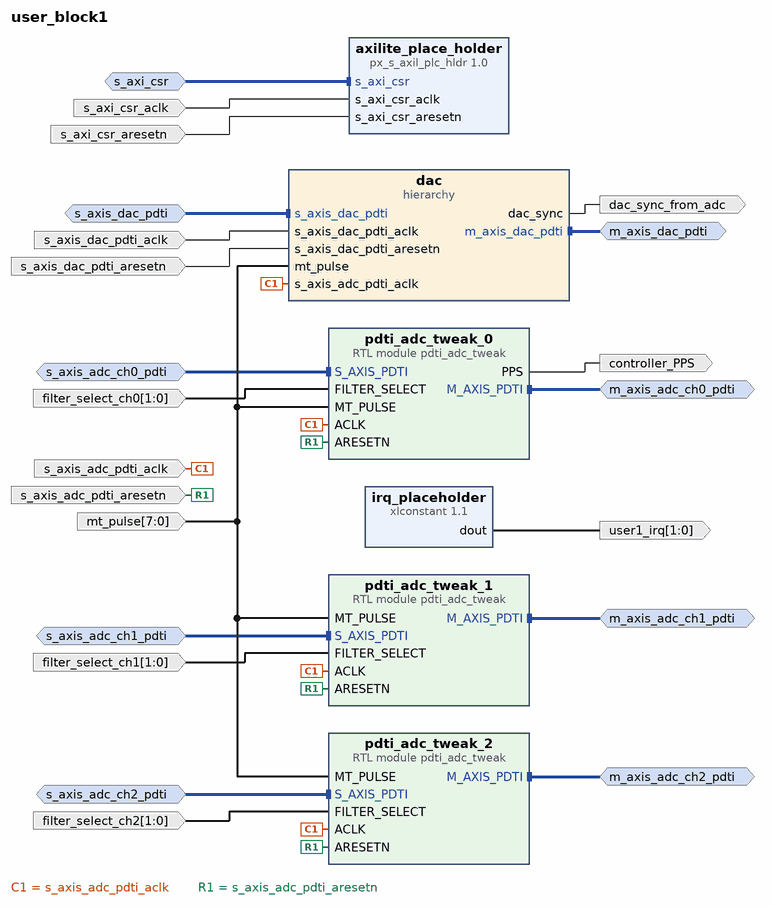
[diagram p0: block diagram of the top level]
# Vivado block design user_block1, xcku060-ffva1156-2-e, Vivado 2019.2
create_bd_design user_block1

create_bd_intf_port -mode Slave -vlnv xilinx.com:interface:aximm_rtl:1.0 s_axi_csr
set_property -dict [list \
  CONFIG.DATA_WIDTH 32 \
  CONFIG.PROTOCOL AXI4LITE \
  CONFIG.ID_WIDTH 0 \
  CONFIG.ADDR_WIDTH 26 \
  CONFIG.AWUSER_WIDTH 0 \
  CONFIG.ARUSER_WIDTH 0 \
  CONFIG.WUSER_WIDTH 0 \
  CONFIG.RUSER_WIDTH 0 \
  CONFIG.BUSER_WIDTH 0 \
  CONFIG.READ_WRITE_MODE READ_WRITE \
  CONFIG.HAS_BURST 0 \
  CONFIG.HAS_LOCK 0 \
  CONFIG.HAS_PROT 1 \
  CONFIG.HAS_CACHE 0 \
  CONFIG.HAS_QOS 0 \
  CONFIG.HAS_REGION 0 \
  CONFIG.HAS_WSTRB 1 \
  CONFIG.HAS_BRESP 1 \
  CONFIG.HAS_RRESP 1 \
  CONFIG.SUPPORTS_NARROW_BURST 0 \
  CONFIG.NUM_READ_OUTSTANDING 1 \
  CONFIG.NUM_WRITE_OUTSTANDING 1 \
  CONFIG.MAX_BURST_LENGTH 1 \
  CONFIG.NUM_READ_THREADS 1 \
  CONFIG.NUM_WRITE_THREADS 1 \
  CONFIG.RUSER_BITS_PER_BYTE 0 \
  CONFIG.WUSER_BITS_PER_BYTE 0 \
] [get_bd_intf_ports s_axi_csr]
create_bd_intf_port -mode Master -vlnv xilinx.com:interface:axis_rtl:1.0 m_axis_adc_ch0_pdti
set_property -dict [list \
  CONFIG.FREQ_HZ 200000000 \
  CONFIG.CLK_DOMAIN user_block1_s_axis_adc_pdti_aclk \
] [get_bd_intf_ports m_axis_adc_ch0_pdti]
create_bd_intf_port -mode Slave -vlnv xilinx.com:interface:axis_rtl:1.0 s_axis_adc_ch0_pdti
set_property -dict [list \
  CONFIG.TDATA_NUM_BYTES 2 \
  CONFIG.TDEST_WIDTH 0 \
  CONFIG.TID_WIDTH 0 \
  CONFIG.TUSER_WIDTH 128 \
  CONFIG.HAS_TREADY 0 \
  CONFIG.HAS_TSTRB 0 \
  CONFIG.HAS_TKEEP 0 \
  CONFIG.HAS_TLAST 0 \
  CONFIG.LAYERED_METADATA undef \
] [get_bd_intf_ports s_axis_adc_ch0_pdti]
create_bd_intf_port -mode Master -vlnv xilinx.com:interface:axis_rtl:1.0 m_axis_adc_ch1_pdti
set_property -dict [list \
  CONFIG.FREQ_HZ 200000000 \
  CONFIG.CLK_DOMAIN user_block1_s_axis_adc_pdti_aclk \
] [get_bd_intf_ports m_axis_adc_ch1_pdti]
create_bd_intf_port -mode Slave -vlnv xilinx.com:interface:axis_rtl:1.0 s_axis_adc_ch1_pdti
set_property -dict [list \
  CONFIG.TDATA_NUM_BYTES 2 \
  CONFIG.TDEST_WIDTH 0 \
  CONFIG.TID_WIDTH 0 \
  CONFIG.TUSER_WIDTH 128 \
  CONFIG.HAS_TREADY 0 \
  CONFIG.HAS_TSTRB 0 \
  CONFIG.HAS_TKEEP 0 \
  CONFIG.HAS_TLAST 0 \
  CONFIG.LAYERED_METADATA undef \
] [get_bd_intf_ports s_axis_adc_ch1_pdti]
create_bd_intf_port -mode Master -vlnv xilinx.com:interface:axis_rtl:1.0 m_axis_adc_ch2_pdti
set_property -dict [list \
  CONFIG.FREQ_HZ 200000000 \
  CONFIG.CLK_DOMAIN user_block1_s_axis_adc_pdti_aclk \
] [get_bd_intf_ports m_axis_adc_ch2_pdti]
create_bd_intf_port -mode Slave -vlnv xilinx.com:interface:axis_rtl:1.0 s_axis_adc_ch2_pdti
set_property -dict [list \
  CONFIG.TDATA_NUM_BYTES 2 \
  CONFIG.TDEST_WIDTH 0 \
  CONFIG.TID_WIDTH 0 \
  CONFIG.TUSER_WIDTH 128 \
  CONFIG.HAS_TREADY 0 \
  CONFIG.HAS_TSTRB 0 \
  CONFIG.HAS_TKEEP 0 \
  CONFIG.HAS_TLAST 0 \
  CONFIG.LAYERED_METADATA undef \
] [get_bd_intf_ports s_axis_adc_ch2_pdti]
create_bd_intf_port -mode Slave -vlnv xilinx.com:interface:axis_rtl:1.0 s_axis_dac_pdti
set_property -dict [list \
  CONFIG.TDATA_NUM_BYTES 4 \
  CONFIG.TDEST_WIDTH 0 \
  CONFIG.TID_WIDTH 0 \
  CONFIG.TUSER_WIDTH 128 \
  CONFIG.HAS_TREADY 0 \
  CONFIG.HAS_TSTRB 0 \
  CONFIG.HAS_TKEEP 0 \
  CONFIG.HAS_TLAST 0 \
  CONFIG.LAYERED_METADATA undef \
] [get_bd_intf_ports s_axis_dac_pdti]
create_bd_intf_port -mode Master -vlnv xilinx.com:interface:axis_rtl:1.0 m_axis_dac_pdti
set_property -dict [list \
  CONFIG.FREQ_HZ 250000000 \
  CONFIG.CLK_DOMAIN user_block1_s_axis_dac_pdti_aclk \
] [get_bd_intf_ports m_axis_dac_pdti]
create_bd_port -dir I -type clk s_axi_csr_aclk
set_property -dict {CONFIG.ASSOCIATED_BUSIF s_axi_csr CONFIG.FREQ_HZ 250000000} [get_bd_ports s_axi_csr_aclk]
create_bd_port -dir I -type rst s_axi_csr_aresetn
create_bd_port -dir O -from 1 -to 0 user1_irq
create_bd_port -dir I -type clk s_axis_adc_pdti_aclk
set_property -dict [list \
  CONFIG.ASSOCIATED_BUSIF s_axis_adc_ch0_pdti:s_axis_adc_ch1_pdti:s_axis_adc_ch2_pdti:m_axis_adc_ch0_pdti:m_axis_adc_ch1_pdti:m_axis_adc_ch2_pdti \
  CONFIG.ASSOCIATED_RESET s_axis_adc_pdti_aresetn \
  CONFIG.CLK_DOMAIN user_block1_s_axis_adc_pdti_aclk \
  CONFIG.FREQ_HZ 200000000 \
] [get_bd_ports s_axis_adc_pdti_aclk]
create_bd_port -dir I -from 7 -to 0 mt_pulse
create_bd_port -dir I -type rst s_axis_adc_pdti_aresetn
create_bd_port -dir I -type clk s_axis_dac_pdti_aclk
set_property -dict [list \
  CONFIG.ASSOCIATED_BUSIF s_axis_dac_pdti:m_axis_dac_pdti \
  CONFIG.ASSOCIATED_RESET s_axis_dac_pdti_aresetn:s_axis_dac_pdti_aresetn \
  CONFIG.CLK_DOMAIN user_block1_s_axis_dac_pdti_aclk \
  CONFIG.FREQ_HZ 250000000 \
] [get_bd_ports s_axis_dac_pdti_aclk]
create_bd_port -dir I -type rst s_axis_dac_pdti_aresetn
create_bd_port -dir I -from 1 -to 0 filter_select_ch0
create_bd_port -dir O controller_PPS
create_bd_port -dir I -from 1 -to 0 filter_select_ch1
create_bd_port -dir I -from 1 -to 0 filter_select_ch2
create_bd_port -dir O dac_sync_from_adc

create_bd_cell -type hier dac
create_bd_cell -type module -reference pdti_adc_tweak pdti_adc_tweak_0
create_bd_cell -type module -reference pdti_adc_tweak pdti_adc_tweak_1
set_property -dict {CONFIG.mt_pulse_bit 2} [get_bd_cells pdti_adc_tweak_1]
create_bd_cell -type module -reference pdti_adc_tweak pdti_adc_tweak_2
set_property -dict {CONFIG.mt_pulse_bit 3} [get_bd_cells pdti_adc_tweak_2]
create_bd_cell -type ip -vlnv pentek.com:px_ip:px_s_axil_plc_hldr:1.0 axilite_place_holder
set_property -dict {CONFIG.address_width 26} [get_bd_cells axilite_place_holder]
create_bd_cell -type ip -vlnv xilinx.com:ip:xlconstant:1.1 irq_placeholder
set_property -dict {CONFIG.CONST_VAL 0 CONFIG.CONST_WIDTH 2} [get_bd_cells irq_placeholder]

# ---- hierarchy /dac ----
current_bd_instance /dac
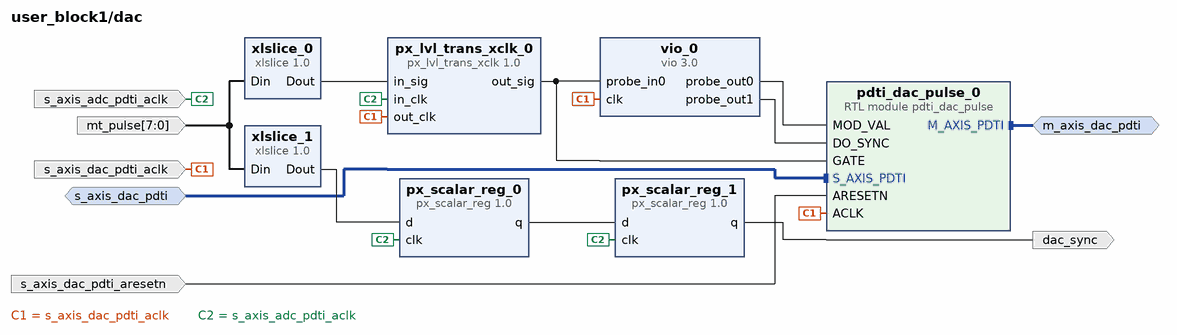
[diagram p1: block diagram inside /dac]
create_bd_intf_pin -mode Slave -vlnv xilinx.com:interface:axis_rtl:1.0 s_axis_dac_pdti
create_bd_intf_pin -mode Master -vlnv xilinx.com:interface:axis_rtl:1.0 m_axis_dac_pdti
create_bd_pin -dir I -type clk s_axis_dac_pdti_aclk
create_bd_pin -dir I -type rst s_axis_dac_pdti_aresetn
create_bd_pin -dir I -type clk s_axis_adc_pdti_aclk
create_bd_pin -dir I -from 7 -to 0 mt_pulse
create_bd_pin -dir O dac_sync

create_bd_cell -type module -reference pdti_dac_pulse pdti_dac_pulse_0
create_bd_cell -type ip -vlnv pentek.com:user:px_lvl_trans_xclk:1.0 px_lvl_trans_xclk_0
create_bd_cell -type ip -vlnv xilinx.com:ip:vio:3.0 vio_0
set_property -dict [list \
  CONFIG.C_NUM_PROBE_OUT 2 \
  CONFIG.C_PROBE_OUT0_INIT_VAL 0x00007FFF \
  CONFIG.C_PROBE_OUT0_WIDTH 32 \
  CONFIG.C_PROBE_OUT1_INIT_VAL 0x1 \
] [get_bd_cells vio_0]
create_bd_cell -type ip -vlnv xilinx.com:ip:xlslice:1.0 xlslice_0
set_property -dict {CONFIG.DIN_FROM 4 CONFIG.DIN_TO 4 CONFIG.DIN_WIDTH 8 CONFIG.DOUT_WIDTH 1} [get_bd_cells xlslice_0]
create_bd_cell -type ip -vlnv pentek.com:px_ip:px_scalar_reg:1.0 px_scalar_reg_0
create_bd_cell -type ip -vlnv pentek.com:px_ip:px_scalar_reg:1.0 px_scalar_reg_1
create_bd_cell -type ip -vlnv xilinx.com:ip:xlslice:1.0 xlslice_1
set_property -dict {CONFIG.DIN_FROM 7 CONFIG.DIN_TO 7 CONFIG.DIN_WIDTH 8 CONFIG.DOUT_WIDTH 1} [get_bd_cells xlslice_1]

# ---- connections ----

current_bd_instance /dac
connect_bd_intf_net -intf_net Conn1 [get_bd_intf_pins m_axis_dac_pdti] [get_bd_intf_pins pdti_dac_pulse_0/M_AXIS_PDTI]
connect_bd_intf_net [get_bd_intf_pins s_axis_dac_pdti] [get_bd_intf_pins pdti_dac_pulse_0/S_AXIS_PDTI]
connect_bd_net -net aresetn_1 [get_bd_pins s_axis_dac_pdti_aresetn] [get_bd_pins pdti_dac_pulse_0/ARESETN]
connect_bd_net -net aclk_1 [get_bd_pins s_axis_dac_pdti_aclk] \
  [get_bd_pins pdti_dac_pulse_0/ACLK] [get_bd_pins px_lvl_trans_xclk_0/out_clk] [get_bd_pins vio_0/clk]
connect_bd_net [get_bd_pins px_lvl_trans_xclk_0/out_sig] [get_bd_pins pdti_dac_pulse_0/GATE] [get_bd_pins vio_0/probe_in0]
connect_bd_net [get_bd_pins s_axis_adc_pdti_aclk] \
  [get_bd_pins px_lvl_trans_xclk_0/in_clk] [get_bd_pins px_scalar_reg_1/clk] [get_bd_pins px_scalar_reg_0/clk]
connect_bd_net [get_bd_pins xlslice_0/Dout] [get_bd_pins px_lvl_trans_xclk_0/in_sig]
connect_bd_net [get_bd_pins mt_pulse] [get_bd_pins xlslice_0/Din] [get_bd_pins xlslice_1/Din]
connect_bd_net [get_bd_pins vio_0/probe_out0] [get_bd_pins pdti_dac_pulse_0/MOD_VAL]
connect_bd_net [get_bd_pins vio_0/probe_out1] [get_bd_pins pdti_dac_pulse_0/DO_SYNC]
connect_bd_net [get_bd_pins px_scalar_reg_0/q] [get_bd_pins px_scalar_reg_1/d]
connect_bd_net [get_bd_pins xlslice_1/Dout] [get_bd_pins px_scalar_reg_0/d]
connect_bd_net [get_bd_pins px_scalar_reg_1/q] [get_bd_pins dac_sync]
set_property HDL_ATTRIBUTE.DEBUG true [get_bd_intf_nets Conn1]
set_property HDL_ATTRIBUTE.MARK_DEBUG true [get_bd_intf_nets Conn1]

current_bd_instance /
connect_bd_intf_net [get_bd_intf_ports m_axis_adc_ch1_pdti] [get_bd_intf_pins pdti_adc_tweak_1/M_AXIS_PDTI]
connect_bd_intf_net [get_bd_intf_ports m_axis_adc_ch0_pdti] [get_bd_intf_pins pdti_adc_tweak_0/M_AXIS_PDTI]
connect_bd_intf_net [get_bd_intf_ports s_axis_adc_ch0_pdti] [get_bd_intf_pins pdti_adc_tweak_0/S_AXIS_PDTI]
connect_bd_intf_net -intf_net dac_M_AXIS_PDTI [get_bd_intf_ports m_axis_dac_pdti] [get_bd_intf_pins dac/m_axis_dac_pdti]
connect_bd_intf_net [get_bd_intf_ports s_axis_dac_pdti] [get_bd_intf_pins dac/s_axis_dac_pdti]
connect_bd_intf_net [get_bd_intf_ports s_axis_adc_ch2_pdti] [get_bd_intf_pins pdti_adc_tweak_2/S_AXIS_PDTI]
connect_bd_intf_net [get_bd_intf_ports s_axis_adc_ch1_pdti] [get_bd_intf_pins pdti_adc_tweak_1/S_AXIS_PDTI]
connect_bd_intf_net [get_bd_intf_ports s_axi_csr] [get_bd_intf_pins axilite_place_holder/s_axi_csr]
connect_bd_intf_net [get_bd_intf_ports m_axis_adc_ch2_pdti] [get_bd_intf_pins pdti_adc_tweak_2/M_AXIS_PDTI]
connect_bd_net [get_bd_ports s_axi_csr_aclk] [get_bd_pins axilite_place_holder/s_axi_csr_aclk]
connect_bd_net [get_bd_ports s_axi_csr_aresetn] [get_bd_pins axilite_place_holder/s_axi_csr_aresetn]
connect_bd_net -net xlconstant_0_dout [get_bd_pins irq_placeholder/dout] [get_bd_ports user1_irq]
connect_bd_net [get_bd_ports s_axis_adc_pdti_aclk] \
  [get_bd_pins pdti_adc_tweak_0/ACLK] [get_bd_pins pdti_adc_tweak_1/ACLK] [get_bd_pins pdti_adc_tweak_2/ACLK] \
  [get_bd_pins dac/s_axis_adc_pdti_aclk]
connect_bd_net [get_bd_ports mt_pulse] \
  [get_bd_pins pdti_adc_tweak_0/MT_PULSE] [get_bd_pins pdti_adc_tweak_1/MT_PULSE] [get_bd_pins pdti_adc_tweak_2/MT_PULSE] \
  [get_bd_pins dac/mt_pulse]
connect_bd_net [get_bd_ports s_axis_adc_pdti_aresetn] \
  [get_bd_pins pdti_adc_tweak_0/ARESETN] [get_bd_pins pdti_adc_tweak_1/ARESETN] [get_bd_pins pdti_adc_tweak_2/ARESETN]
connect_bd_net [get_bd_ports s_axis_dac_pdti_aclk] [get_bd_pins dac/s_axis_dac_pdti_aclk]
connect_bd_net [get_bd_ports s_axis_dac_pdti_aresetn] [get_bd_pins dac/s_axis_dac_pdti_aresetn]
connect_bd_net -net filter_select_ch0_1 [get_bd_ports filter_select_ch0] [get_bd_pins pdti_adc_tweak_0/FILTER_SELECT]
connect_bd_net [get_bd_pins pdti_adc_tweak_0/PPS] [get_bd_ports controller_PPS]
connect_bd_net -net filter_select_ch1_1 [get_bd_ports filter_select_ch1] [get_bd_pins pdti_adc_tweak_1/FILTER_SELECT]
connect_bd_net -net filter_select_ch2_1 [get_bd_ports filter_select_ch2] [get_bd_pins pdti_adc_tweak_2/FILTER_SELECT]
connect_bd_net -net dac_sync_from_adc [get_bd_pins dac/dac_sync] [get_bd_ports dac_sync_from_adc]
set_property HDL_ATTRIBUTE.DEBUG true [get_bd_intf_nets dac_M_AXIS_PDTI]

# ---- address map ----
assign_bd_address -offset 0x3000000 -range 8M -target_address_space [get_bd_addr_spaces s_axi_csr] [get_bd_addr_segs axilite_place_holder/s_axi_csr/reg0]

validate_bd_design
save_bd_design
